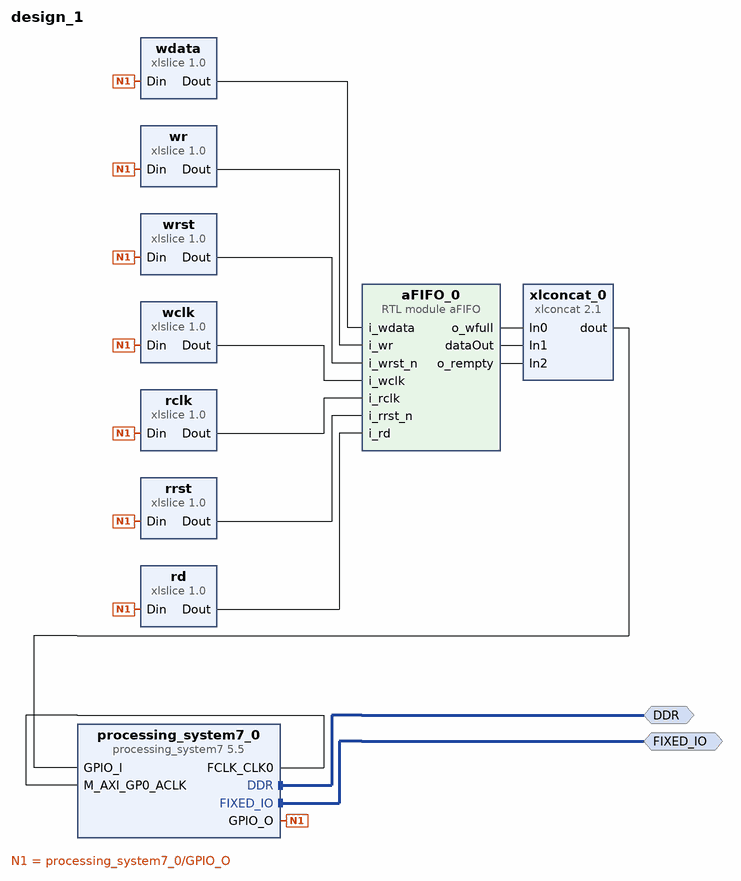
[diagram p0: block diagram of the top level]
# Vivado block design design_1, xc7z020clg400-1, Vivado 2019.2
create_bd_design design_1

create_bd_intf_port -mode Master -vlnv xilinx.com:interface:ddrx_rtl:1.0 DDR
create_bd_intf_port -mode Master -vlnv xilinx.com:display_processing_system7:fixedio_rtl:1.0 FIXED_IO

create_bd_cell -type ip -vlnv xilinx.com:ip:processing_system7:5.5 processing_system7_0
set_property -dict [list \
  CONFIG.PCW_APU_PERIPHERAL_FREQMHZ 650 \
  CONFIG.PCW_CRYSTAL_PERIPHERAL_FREQMHZ 50 \
  CONFIG.PCW_ENET0_ENET0_IO {MIO 16 .. 27} \
  CONFIG.PCW_ENET0_GRP_MDIO_ENABLE 1 \
  CONFIG.PCW_ENET0_GRP_MDIO_IO {MIO 52 .. 53} \
  CONFIG.PCW_ENET0_PERIPHERAL_ENABLE 1 \
  CONFIG.PCW_ENET0_RESET_ENABLE 1 \
  CONFIG.PCW_ENET0_RESET_IO {MIO 9} \
  CONFIG.PCW_ENET_RESET_ENABLE 1 \
  CONFIG.PCW_ENET_RESET_SELECT {Share reset pin} \
  CONFIG.PCW_FPGA0_PERIPHERAL_FREQMHZ 100 \
  CONFIG.PCW_FPGA1_PERIPHERAL_FREQMHZ 50 \
  CONFIG.PCW_GPIO_EMIO_GPIO_ENABLE 1 \
  CONFIG.PCW_GPIO_EMIO_GPIO_IO 40 \
  CONFIG.PCW_GPIO_EMIO_GPIO_WIDTH 40 \
  CONFIG.PCW_GPIO_MIO_GPIO_ENABLE 1 \
  CONFIG.PCW_GPIO_MIO_GPIO_IO MIO \
  CONFIG.PCW_I2C_RESET_ENABLE 1 \
  CONFIG.PCW_M_AXI_GP0_FREQMHZ 10 \
  CONFIG.PCW_PERIPHERAL_BOARD_PRESET None \
  CONFIG.PCW_PRESET_BANK1_VOLTAGE {LVCMOS 1.8V} \
  CONFIG.PCW_QSPI_GRP_FBCLK_ENABLE 1 \
  CONFIG.PCW_QSPI_GRP_FBCLK_IO {MIO 8} \
  CONFIG.PCW_QSPI_GRP_SINGLE_SS_ENABLE 1 \
  CONFIG.PCW_QSPI_GRP_SINGLE_SS_IO {MIO 1 .. 6} \
  CONFIG.PCW_QSPI_PERIPHERAL_ENABLE 1 \
  CONFIG.PCW_QSPI_QSPI_IO {MIO 1 .. 6} \
  CONFIG.PCW_SD0_GRP_CD_ENABLE 1 \
  CONFIG.PCW_SD0_GRP_CD_IO {MIO 47} \
  CONFIG.PCW_SD0_GRP_WP_ENABLE 0 \
  CONFIG.PCW_SD0_PERIPHERAL_ENABLE 1 \
  CONFIG.PCW_SD0_SD0_IO {MIO 40 .. 45} \
  CONFIG.PCW_SDIO_PERIPHERAL_FREQMHZ 50 \
  CONFIG.PCW_SINGLE_QSPI_DATA_MODE x4 \
  CONFIG.PCW_UART0_PERIPHERAL_ENABLE 1 \
  CONFIG.PCW_UART0_UART0_IO {MIO 14 .. 15} \
  CONFIG.PCW_UART1_PERIPHERAL_ENABLE 0 \
  CONFIG.PCW_UART_PERIPHERAL_FREQMHZ 100 \
  CONFIG.PCW_UIPARAM_DDR_BUS_WIDTH {16 Bit} \
  CONFIG.PCW_UIPARAM_DDR_FREQ_MHZ 525 \
  CONFIG.PCW_UIPARAM_DDR_PARTNO {MT41J256M16 RE-125} \
  CONFIG.PCW_USB0_PERIPHERAL_ENABLE 1 \
  CONFIG.PCW_USB0_RESET_ENABLE 1 \
  CONFIG.PCW_USB0_RESET_IO {MIO 46} \
  CONFIG.PCW_USB0_USB0_IO {MIO 28 .. 39} \
  CONFIG.PCW_USB_RESET_ENABLE 1 \
  CONFIG.PCW_USB_RESET_SELECT {Share reset pin} \
] [get_bd_cells processing_system7_0]
# 480 more settings of processing_system7_0 are not shown: defaults, MIO pin electricals, DDR timing, and values the tool derives
create_bd_cell -type ip -vlnv xilinx.com:ip:xlconcat:2.1 xlconcat_0
set_property -dict {CONFIG.IN0_WIDTH 1 CONFIG.IN1_WIDTH 16 CONFIG.IN2_WIDTH 1 CONFIG.NUM_PORTS 3} [get_bd_cells xlconcat_0]
create_bd_cell -type ip -vlnv xilinx.com:ip:xlslice:1.0 wclk
set_property -dict {CONFIG.DIN_FROM 18 CONFIG.DIN_TO 18 CONFIG.DIN_WIDTH 40 CONFIG.DOUT_WIDTH 1} [get_bd_cells wclk]
create_bd_cell -type ip -vlnv xilinx.com:ip:xlslice:1.0 wrst
set_property -dict {CONFIG.DIN_FROM 19 CONFIG.DIN_TO 19 CONFIG.DIN_WIDTH 40 CONFIG.DOUT_WIDTH 1} [get_bd_cells wrst]
create_bd_cell -type ip -vlnv xilinx.com:ip:xlslice:1.0 wr
set_property -dict {CONFIG.DIN_FROM 20 CONFIG.DIN_TO 20 CONFIG.DIN_WIDTH 40 CONFIG.DOUT_WIDTH 1} [get_bd_cells wr]
create_bd_cell -type ip -vlnv xilinx.com:ip:xlslice:1.0 wdata
set_property -dict {CONFIG.DIN_FROM 36 CONFIG.DIN_TO 21 CONFIG.DIN_WIDTH 40 CONFIG.DOUT_WIDTH 16} [get_bd_cells wdata]
create_bd_cell -type ip -vlnv xilinx.com:ip:xlslice:1.0 rclk
set_property -dict {CONFIG.DIN_FROM 37 CONFIG.DIN_TO 37 CONFIG.DIN_WIDTH 40 CONFIG.DOUT_WIDTH 1} [get_bd_cells rclk]
create_bd_cell -type ip -vlnv xilinx.com:ip:xlslice:1.0 rrst
set_property -dict {CONFIG.DIN_FROM 38 CONFIG.DIN_TO 38 CONFIG.DIN_WIDTH 40 CONFIG.DOUT_WIDTH 1} [get_bd_cells rrst]
create_bd_cell -type ip -vlnv xilinx.com:ip:xlslice:1.0 rd
set_property -dict {CONFIG.DIN_FROM 39 CONFIG.DIN_TO 39 CONFIG.DIN_WIDTH 40 CONFIG.DOUT_WIDTH 1} [get_bd_cells rd]
create_bd_cell -type module -reference aFIFO aFIFO_0

# ---- connections ----

connect_bd_intf_net [get_bd_intf_ports DDR] [get_bd_intf_pins processing_system7_0/DDR]
connect_bd_intf_net [get_bd_intf_ports FIXED_IO] [get_bd_intf_pins processing_system7_0/FIXED_IO]
connect_bd_net [get_bd_pins processing_system7_0/FCLK_CLK0] [get_bd_pins processing_system7_0/M_AXI_GP0_ACLK]
connect_bd_net [get_bd_pins aFIFO_0/o_wfull] [get_bd_pins xlconcat_0/In0]
connect_bd_net [get_bd_pins aFIFO_0/dataOut] [get_bd_pins xlconcat_0/In1]
connect_bd_net [get_bd_pins aFIFO_0/o_rempty] [get_bd_pins xlconcat_0/In2]
connect_bd_net [get_bd_pins xlconcat_0/dout] [get_bd_pins processing_system7_0/GPIO_I]
connect_bd_net [get_bd_pins wdata/Dout] [get_bd_pins aFIFO_0/i_wdata]
connect_bd_net [get_bd_pins wr/Dout] [get_bd_pins aFIFO_0/i_wr]
connect_bd_net [get_bd_pins wrst/Dout] [get_bd_pins aFIFO_0/i_wrst_n]
connect_bd_net [get_bd_pins wclk/Dout] [get_bd_pins aFIFO_0/i_wclk]
connect_bd_net [get_bd_pins rclk/Dout] [get_bd_pins aFIFO_0/i_rclk]
connect_bd_net [get_bd_pins rrst/Dout] [get_bd_pins aFIFO_0/i_rrst_n]
connect_bd_net [get_bd_pins rd/Dout] [get_bd_pins aFIFO_0/i_rd]
connect_bd_net [get_bd_pins processing_system7_0/GPIO_O] \
  [get_bd_pins wclk/Din] [get_bd_pins wrst/Din] [get_bd_pins wr/Din] [get_bd_pins wdata/Din] [get_bd_pins rclk/Din] \
  [get_bd_pins rrst/Din] [get_bd_pins rd/Din]

validate_bd_design
save_bd_design
